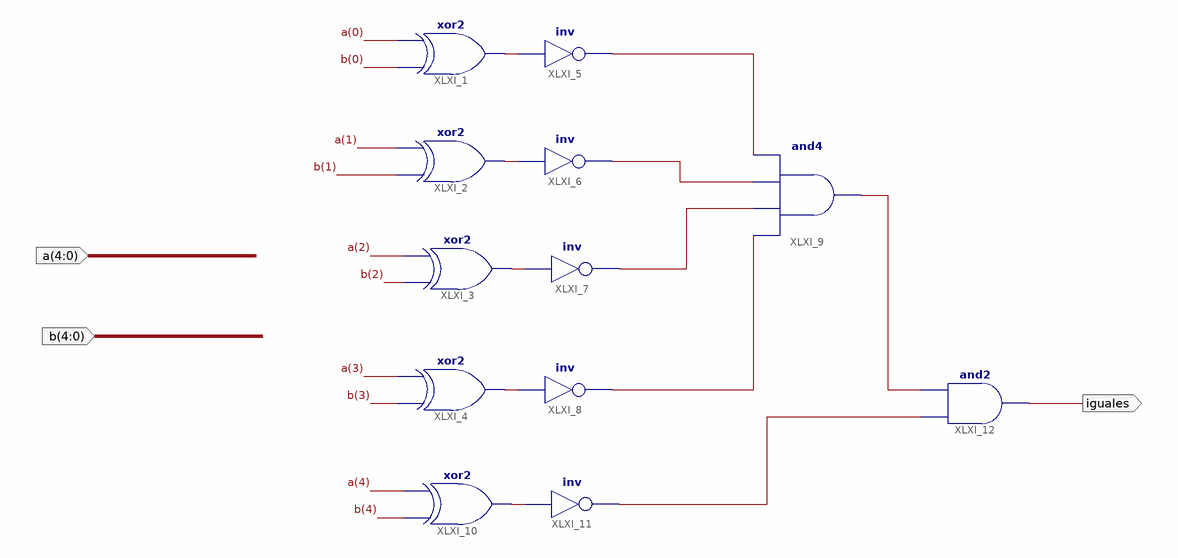
[diagram p0: schematic sheet 1]
// Xilinx ISE schematic COMPARADOR5.sch (artix7) as structural Verilog: 12 symbols, 3 ports
module COMPARADOR5 (
  input  [4:0] a,
  input  [4:0] b,
  output iguales
);

  wire XLXN_3, XLXN_4, XLXN_5, XLXN_6, XLXN_7, XLXN_8, XLXN_9, XLXN_10, XLXN_20, XLXN_23, XLXN_24;

  xor XLXI_1 (XLXN_3, b[0], a[0]);
  xor XLXI_2 (XLXN_4, b[1], a[1]);
  xor XLXI_3 (XLXN_5, b[2], a[2]);
  xor XLXI_4 (XLXN_6, b[3], a[3]);
  not XLXI_5 (XLXN_10, XLXN_3);
  not XLXI_6 (XLXN_7, XLXN_4);
  not XLXI_7 (XLXN_8, XLXN_5);
  not XLXI_8 (XLXN_9, XLXN_6);
  and XLXI_9 (XLXN_24, XLXN_9, XLXN_8, XLXN_7, XLXN_10);
  xor XLXI_10 (XLXN_20, b[4], a[4]);
  not XLXI_11 (XLXN_23, XLXN_20);
  and XLXI_12 (iguales, XLXN_23, XLXN_24);
endmodule
